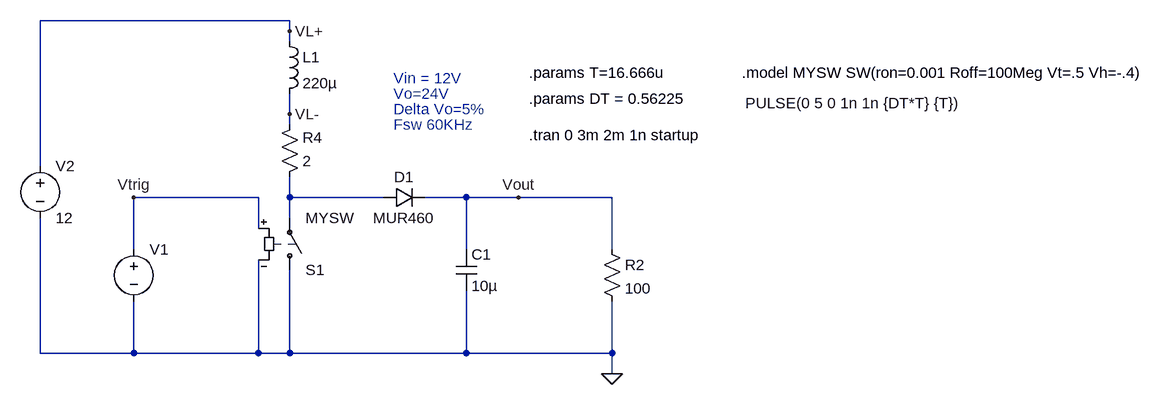
[diagram p0: schematic Draft3_ideal.asc]
Draft3_ideal.asc, the LTspice schematic file:
Version 4
SHEET 1 1324 680
WIRE 0 -208 -384 -208
WIRE 0 -192 0 -208
WIRE 0 -176 0 -192
WIRE 0 -64 0 -96
WIRE 0 -48 0 -64
WIRE -384 16 -384 -208
WIRE -48 64 -240 64
WIRE 0 64 0 32
WIRE 144 64 0 64
WIRE 272 64 208 64
WIRE 352 64 272 64
WIRE 496 64 352 64
WIRE 0 96 0 64
WIRE -48 112 -48 64
WIRE -240 144 -240 64
WIRE 272 144 272 64
WIRE 496 144 496 64
WIRE -384 304 -384 96
WIRE -240 304 -240 224
WIRE -240 304 -384 304
WIRE -48 304 -48 160
WIRE -48 304 -240 304
WIRE 0 304 0 176
WIRE 0 304 -48 304
WIRE 272 304 272 208
WIRE 272 304 0 304
WIRE 496 304 496 224
WIRE 496 304 272 304
WIRE 496 336 496 304
FLAG 496 336 0
FLAG 352 64 Vout
FLAG 0 -192 VL+
FLAG 0 -64 VL-
FLAG -240 64 Vtrig
SYMBOL diode 144 80 R270
WINDOW 0 32 32 VTop 2
WINDOW 3 0 32 VBottom 2
SYMATTR InstName D1
SYMATTR Value MUR460
SYMBOL res -16 48 M180
WINDOW 0 36 76 Left 2
WINDOW 3 36 40 Left 2
SYMATTR InstName R4
SYMATTR Value 2
SYMBOL ind -16 -192 R0
SYMATTR InstName L1
SYMATTR Value 220µ
SYMBOL voltage -240 128 R0
WINDOW 3 941 -209 Left 2
WINDOW 123 0 0 Left 0
WINDOW 39 0 0 Left 0
SYMATTR Value PULSE(0 5 0 1n 1n {DT*T} {T})
SYMATTR InstName V1
SYMBOL voltage -384 0 R0
WINDOW 123 0 0 Left 0
WINDOW 39 0 0 Left 0
SYMATTR InstName V2
SYMATTR Value 12
SYMBOL cap 256 144 R0
SYMATTR InstName C1
SYMATTR Value 10µ
SYMBOL res 480 128 R0
SYMATTR InstName R2
SYMATTR Value 100
SYMBOL sw 0 192 M180
SYMATTR InstName S1
SYMATTR Value MYSW
TEXT 696 -128 Left 2 !.model MYSW SW(ron=0.001 Roff=100Meg Vt=.5 Vh=-.4)
TEXT 368 -32 Left 2 !.tran 0 3m 2m 1n startup
TEXT 160 -120 Left 2 ;Vin = 12V
TEXT 160 -96 Left 2 ;Vo=24V
TEXT 160 -72 Left 2 ;Delta Vo=5%
TEXT 160 -48 Left 2 ;Fsw 60KHz
TEXT 368 -88 Left 2 !.params DT = 0.56225
TEXT 368 -128 Left 2 !.params T=16.666u

The netlist it stands for:
* Draft3_ideal.asc
D1 N001 Vout MUR460
R4 N001 VL- 2
L1 VL+ VL- 220µ
V1 Vtrig 0 PULSE(0 5 0 1n 1n {DT*T} {T})
V2 VL+ 0 12
C1 Vout 0 10µ
R2 Vout 0 100
S1 0 N001 Vtrig 0 MYSW
.model D D
.lib standard.dio
.model MYSW SW(ron=0.001 Roff=100Meg Vt=.5 Vh=-.4)
.tran 0 3m 2m 1n startup
* Vin = 12V
* Vo=24V
* Delta Vo=5%
* Fsw 60KHz
.params DT = 0.56225
.params T=16.666u
.backanno
.end

* Results of the author's LTspice run, read from the files saved beside the schematic
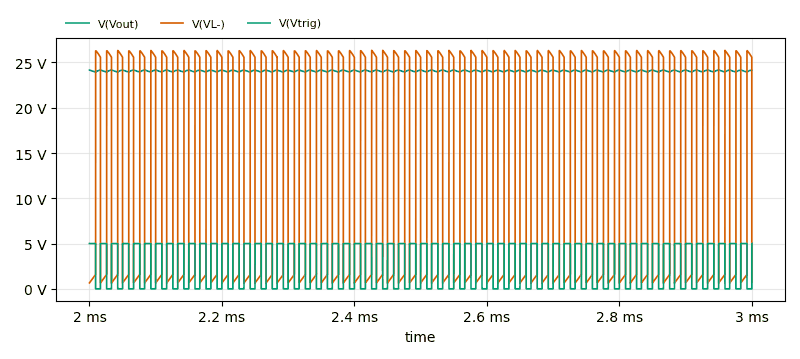
[diagram p1: Transient Analysis of Draft3_ideal.asc, plotted from the saved traces]
* Transient Analysis, 1 run:
*   V(Vout): min 23.94 V, max 24.17 V, average 24.06 V, rms 24.06 V, last 24.16 V
*   V(VL-): min 644.7 mV, max 26.34 V, average 12 V, rms 17.21 V, last 657.4 mV
*   V(Vtrig): min 0 V, max 5 V, average 2.812 V, rms 3.749 V, last 5 V